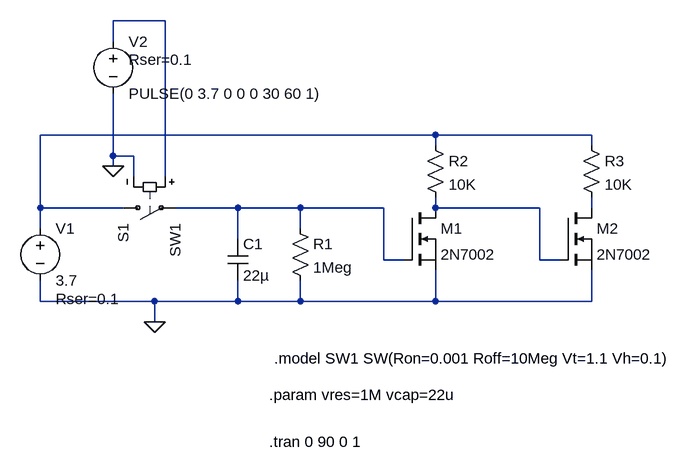
[diagram p0: schematic save_shutdown.asc]
save_shutdown.asc, the LTspice schematic file:
Version 4
SHEET 1 880 680
WIRE -272 -320 -352 -320
WIRE -352 -288 -352 -320
WIRE 144 -144 -464 -144
WIRE 384 -144 144 -144
WIRE 144 -128 144 -144
WIRE 384 -128 384 -144
WIRE -352 -112 -352 -208
WIRE -320 -112 -352 -112
WIRE -352 -96 -352 -112
WIRE -320 -80 -320 -112
WIRE -272 -80 -272 -320
WIRE -464 -32 -464 -144
WIRE -336 -32 -464 -32
WIRE -160 -32 -256 -32
WIRE -64 -32 -160 -32
WIRE 64 -32 -64 -32
WIRE 144 -32 144 -48
WIRE 304 -32 144 -32
WIRE 384 -32 384 -48
WIRE -464 0 -464 -32
WIRE -64 0 -64 -32
WIRE -160 16 -160 -32
WIRE 64 48 64 -32
WIRE 96 48 64 48
WIRE 304 48 304 -32
WIRE 336 48 304 48
WIRE -464 112 -464 80
WIRE -288 112 -464 112
WIRE -160 112 -160 80
WIRE -160 112 -288 112
WIRE -64 112 -64 80
WIRE -64 112 -160 112
WIRE 144 112 144 64
WIRE 144 112 -64 112
WIRE 384 112 384 64
WIRE 384 112 144 112
WIRE -288 144 -288 112
FLAG -288 144 0
FLAG -352 -96 0
SYMBOL res -80 -16 R0
SYMATTR InstName R1
SYMATTR Value 1Meg
SYMBOL cap -176 16 R0
SYMATTR InstName C1
SYMATTR Value 22µ
SYMBOL voltage -464 -16 R0
WINDOW 123 0 0 Left 0
WINDOW 39 24 124 Left 2
SYMATTR SpiceLine Rser=0.1
SYMATTR InstName V1
SYMATTR Value 3.7
SYMBOL nmos 96 -32 R0
SYMATTR InstName M1
SYMATTR Value 2N7002
SYMBOL res 128 -144 R0
SYMATTR InstName R2
SYMATTR Value 10K
SYMBOL voltage -352 -304 R0
WINDOW 123 0 0 Left 0
WINDOW 39 24 44 Left 2
SYMATTR SpiceLine Rser=0.1
SYMATTR InstName V2
SYMATTR Value PULSE(0 3.7 0 0 0 30 60 1)
SYMBOL sw -352 -32 M90
SYMATTR InstName S1
SYMATTR Value SW1
SYMBOL nmos 336 -32 R0
SYMATTR InstName M2
SYMATTR Value 2N7002
SYMBOL res 368 -144 R0
SYMATTR InstName R3
SYMATTR Value 10K
TEXT -112 256 Left 2 !.param vres=1M vcap=22u
TEXT -112 328 Left 2 !.tran 0 90 0 1
TEXT -104 200 Left 2 !.model SW1 SW(Ron=0.001 Roff=10Meg Vt=1.1 Vh=0.1)

The netlist it stands for:
* save_shutdown.asc
R1 N003 0 1Meg
C1 N003 0 22µ
V1 N002 0 3.7 Rser=0.1
M1 N004 N003 0 0 2N7002
R2 N002 N004 10K
V2 N001 0 PULSE(0 3.7 0 0 0 30 60 1) Rser=0.1
S1 N002 N003 N001 0 SW1
M2 N005 N004 0 0 2N7002
R3 N002 N005 10K
.model NMOS NMOS
.model PMOS PMOS
.lib standard.mos
.param vres=1M vcap=22u
.tran 0 90 0 1
.model SW1 SW(Ron=0.001 Roff=10Meg Vt=1.1 Vh=0.1)
.backanno
.end